# EAGLE schematic Clock_1 (EAGLE 9.6.2)
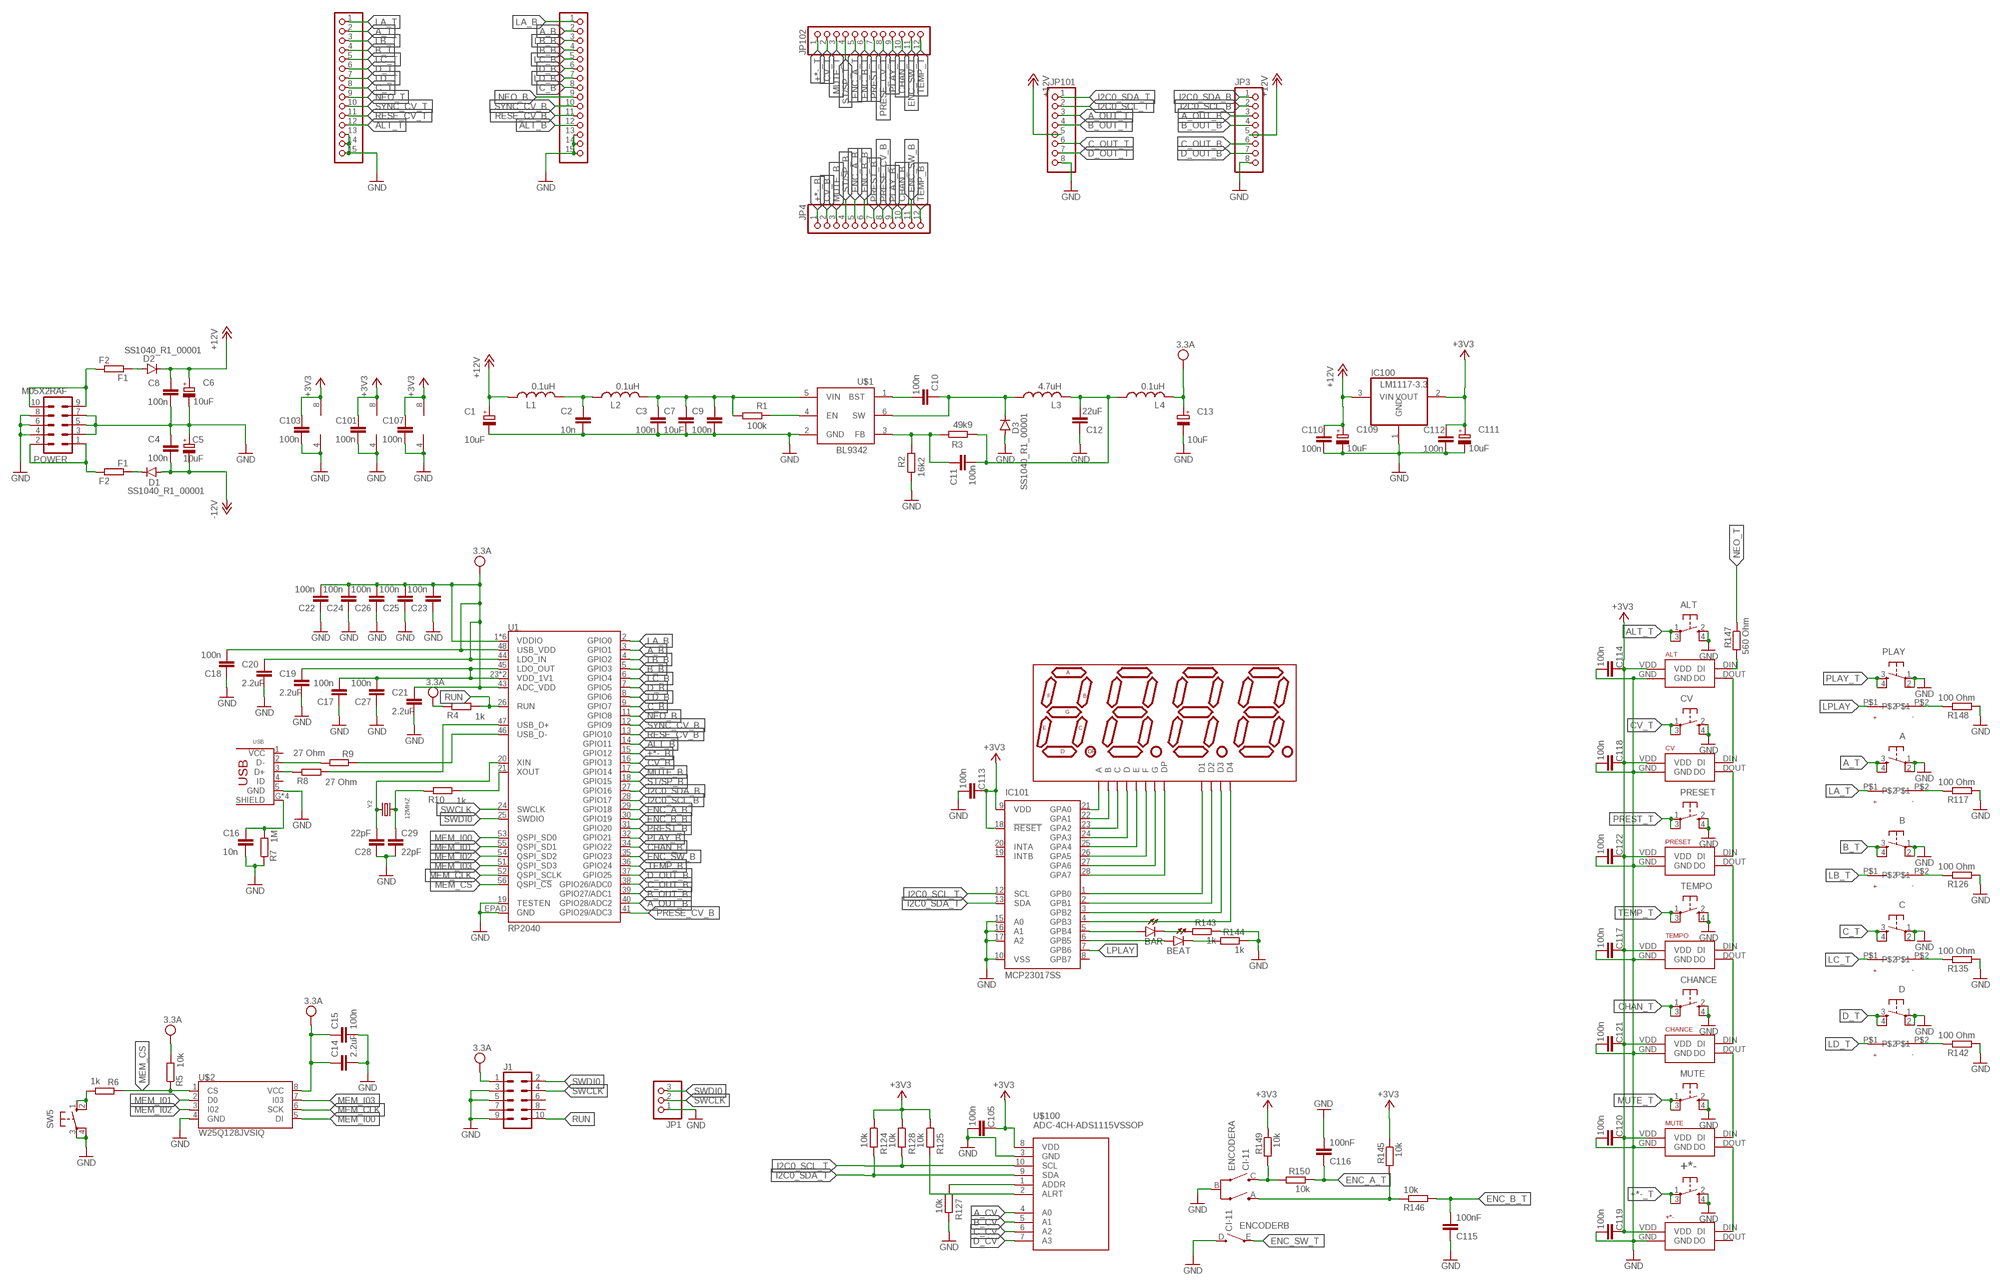
[diagram p0: schematic, sheet 1, part 1 of 2]
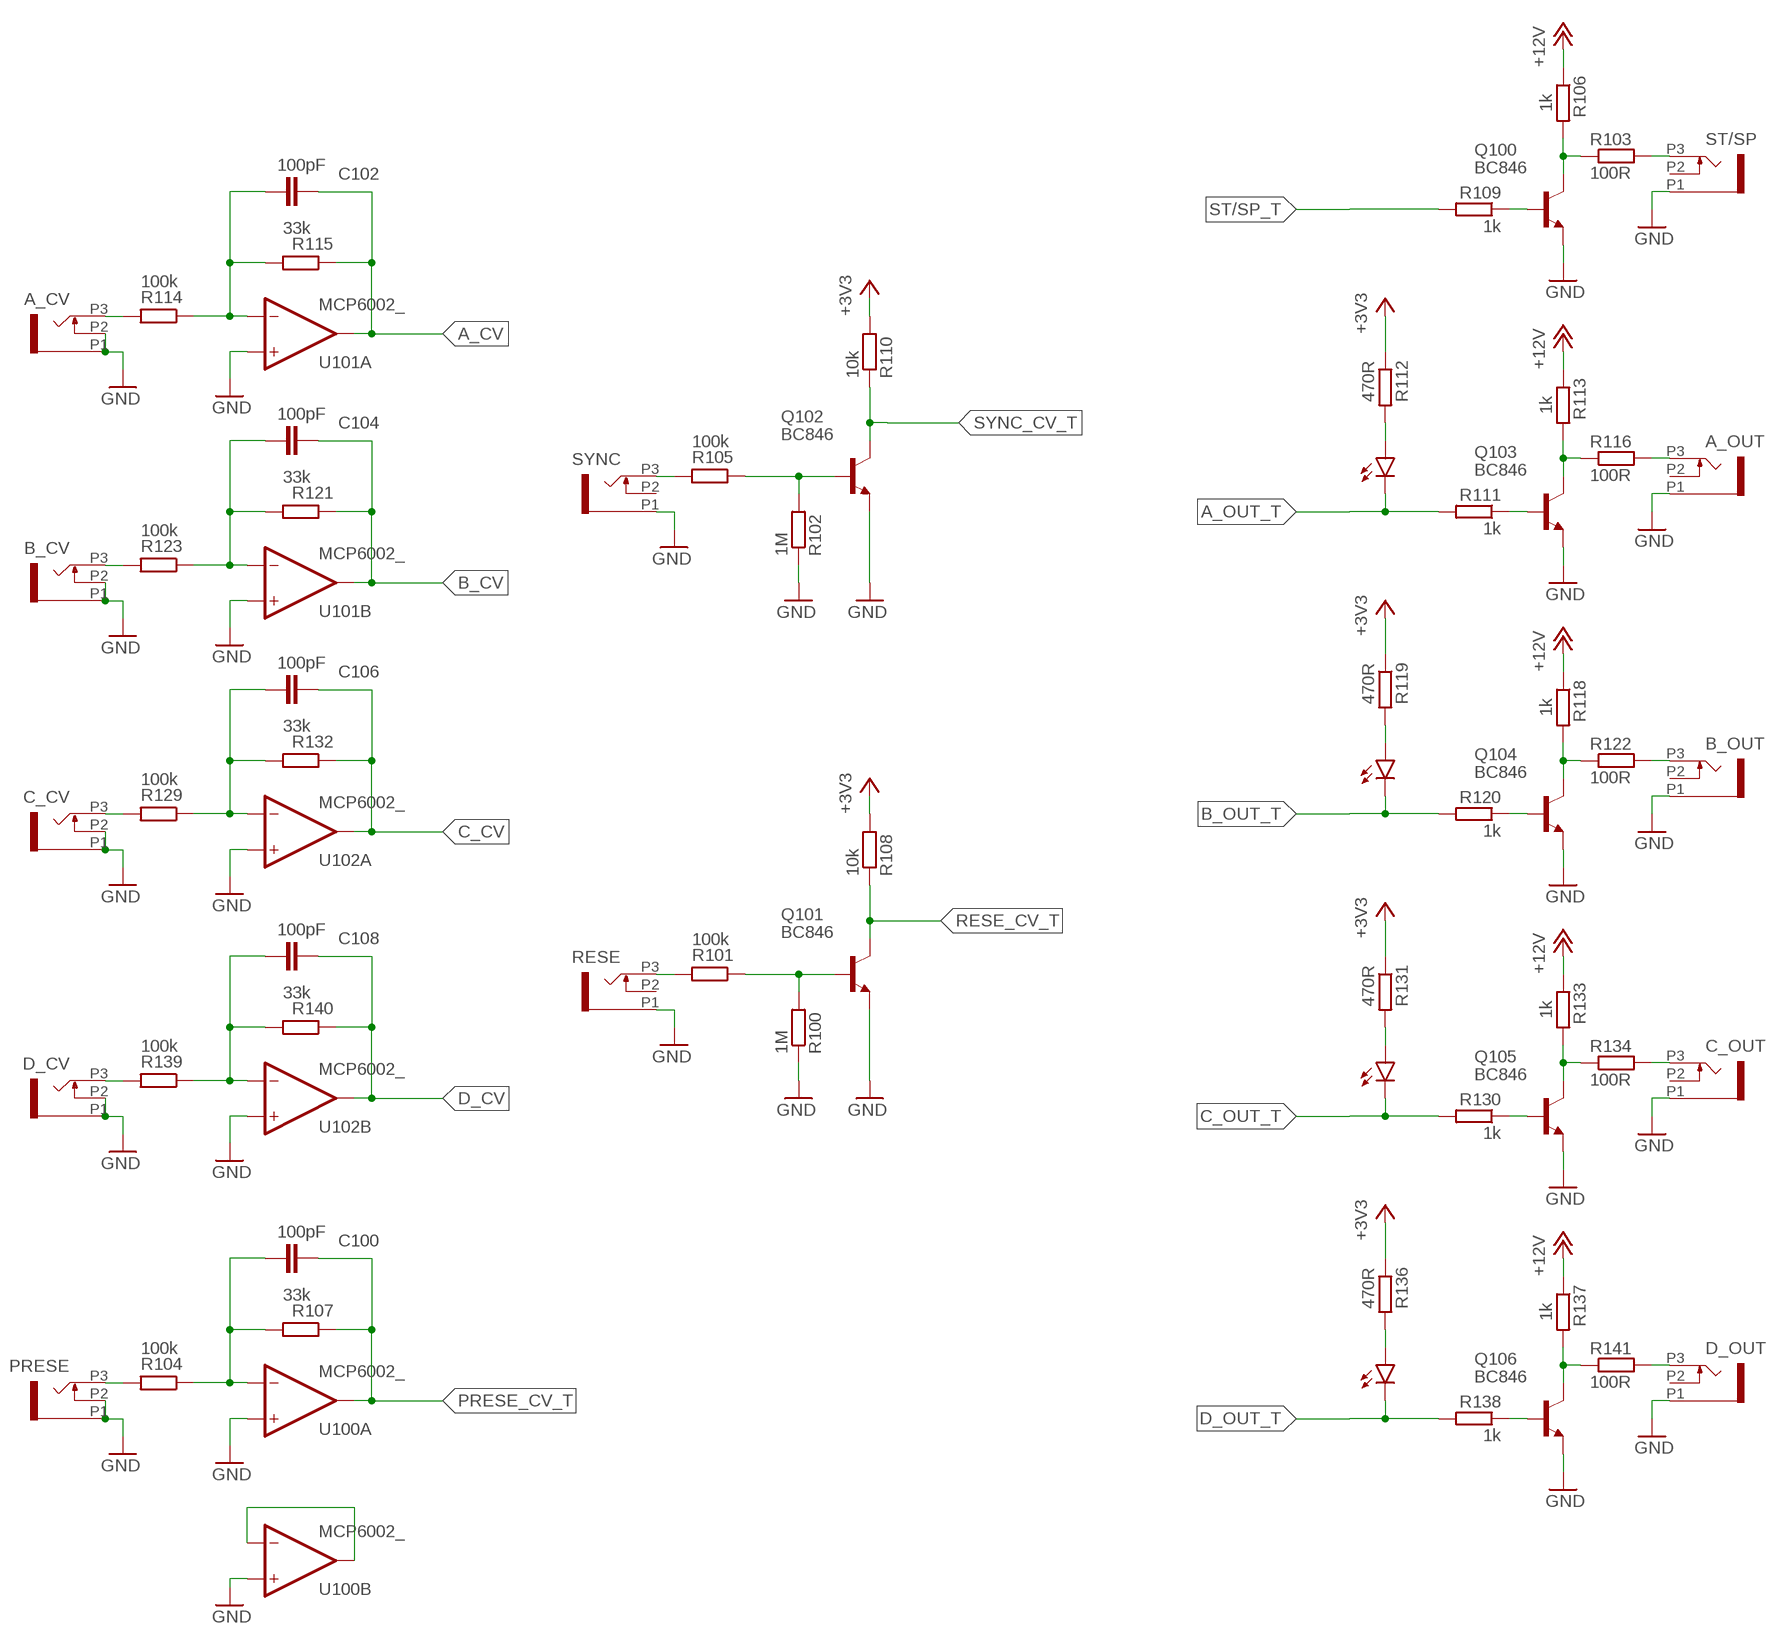
[diagram p1: schematic, sheet 1, part 2 of 2]

## Parts
+*-  BUTTON_NEOPIXELBUTTON_PIXEL_ç  [BUTTON_PIXEL_ç]
A  DTS-6_LEDTME  [TMEBUTTON]
A_CV  OG-PJ301_PJ301_THONKICONNNOHOLER  OG-PJ301_PJ301_THONKICONNNOHOLER_GND_SHORT_PADMINI_GND  [NOHOLER_GND_SHORT_PADMINI_GND]
A_OUT  OG-PJ301_PJ301_THONKICONNNOHOLER  OG-PJ301_PJ301_THONKICONNNOHOLER_GND_SHORT_PADMINI_GND  [NOHOLER_GND_SHORT_PADMINI_GND]
ALT  BUTTON_NEOPIXELBUTTON_PIXEL_ç  [BUTTON_PIXEL_ç]
B  DTS-6_LEDTME  [TMEBUTTON]
B_CV  OG-PJ301_PJ301_THONKICONNNOHOLER  OG-PJ301_PJ301_THONKICONNNOHOLER_GND_SHORT_PADMINI_GND  [NOHOLER_GND_SHORT_PADMINI_GND]
B_OUT  OG-PJ301_PJ301_THONKICONNNOHOLER  OG-PJ301_PJ301_THONKICONNNOHOLER_GND_SHORT_PADMINI_GND  [NOHOLER_GND_SHORT_PADMINI_GND]
BAR  2 MM LED  LED3MM  [LED3MM]
BEAT  2 MM LED  LED3MM  [LED3MM]
C  DTS-6_LEDTME  [TMEBUTTON]
C1  10uF  CPOL-EUB  [PANASONIC_B]
C2  10n  C-EUC0603  [C0603]
C3  100n  C-EUC0603  [C0603]
C4  100n  C-EUC0603  [C0603]
C5  10uF  CPOL-EUB  [PANASONIC_B]
C6  10uF  CPOL-EUB  [PANASONIC_B]
C7  10uF  C-EUC0603  [C0603]
C8  100n  C-EUC0603  [C0603]
C9  100n  C-EUC0603  [C0603]
C10  100n  C-EUC0603  [C0603]
C11  100n  C-EUC0603  [C0603]
C12  22uF  C-EUC0603  [C0603]
C13  10uF  CPOL-EUB  [PANASONIC_B]
C14  2.2uF  C-EUC0603  [C0603]
C15  100n  C-EUC0603  [C0603]
C16  10n  C-EUC0603  [C0603]
C17  100n  C-EUC0603  [C0603]
C18  100n  C-EUC0603  [C0603]
C19  2.2uF  C-EUC0603  [C0603]
C20  2.2uF  C-EUC0603  [C0603]
C21  2.2uF  C-EUC0603  [C0603]
C22  100n  C-EUC0603  [C0603]
C23  100n  C-EUC0603  [C0603]
C24  100n  C-EUC0603  [C0603]
C25  100n  C-EUC0603  [C0603]
C26  100n  C-EUC0603  [C0603]
C27  100n  C-EUC0603  [C0603]
C28  22pF  C-EUC0603  [C0603]
C29  22pF  C-EUC0603  [C0603]
C100  100pF  C-EUC0603  [C0603]
C101  100n  C-EUC0603  [C0603]
C102  100pF  C-EUC0603  [C0603]
C103  100n  C-EUC0603  [C0603]
C104  100pF  C-EUC0603  [C0603]
C105  100n  C-EUC0603  [C0603]
C106  100pF  C-EUC0603  [C0603]
C107  100n  C-EUC0603  [C0603]
C108  100pF  C-EUC0603  [C0603]
C109  10uF  CPOL-EUB  [PANASONIC_B]
C110  100n  C-EUC0603  [C0603]
C111  10uF  CPOL-EUB  [PANASONIC_B]
C112  100n  C-EUC0603  [C0603]
C113  100n  C-EUC0603  [C0603]
C114  100n  C-EUC0603  [C0603]
C115  100nF  C-EUC0603  [C0603]
C116  100nF  C-EUC0603  [C0603]
C117  100n  C-EUC0603  [C0603]
C118  100n  C-EUC0603  [C0603]
C119  100n  C-EUC0603  [C0603]
C120  100n  C-EUC0603  [C0603]
C121  100n  C-EUC0603  [C0603]
C122  100n  C-EUC0603  [C0603]
C_CV  OG-PJ301_PJ301_THONKICONNNOHOLER  OG-PJ301_PJ301_THONKICONNNOHOLER_GND_SHORT_PADMINI_GND  [NOHOLER_GND_SHORT_PADMINI_GND]
C_OUT  OG-PJ301_PJ301_THONKICONNNOHOLER  OG-PJ301_PJ301_THONKICONNNOHOLER_GND_SHORT_PADMINI_GND  [NOHOLER_GND_SHORT_PADMINI_GND]
CHANCE  BUTTON_NEOPIXELBUTTON_PIXEL_ç  [BUTTON_PIXEL_ç]
CV  BUTTON_NEOPIXELBUTTON_PIXEL_ç  [BUTTON_PIXEL_ç]
D  DTS-6_LEDTME  [TMEBUTTON]
D1  SS1040_R1_00001  DIODE-SOD123  [SOD123]
D2  SS1040_R1_00001  DIODE-SOD123  [SOD123]
D3  SS1040_R1_00001  DIODE-SOD123  [SOD123]
D_CV  OG-PJ301_PJ301_THONKICONNNOHOLER  OG-PJ301_PJ301_THONKICONNNOHOLER_GND_SHORT_PADMINI_GND  [NOHOLER_GND_SHORT_PADMINI_GND]
D_OUT  OG-PJ301_PJ301_THONKICONNNOHOLER  OG-PJ301_PJ301_THONKICONNNOHOLER_GND_SHORT_PADMINI_GND  [NOHOLER_GND_SHORT_PADMINI_GND]
ENCODER  CI-11  [CI-11]
F1  F2  R-EU_R0603  [R0603]
F2  F1  R-EU_R0603  [R0603]
IC100  LM1117-3.3  REG1117  [SOT223]
IC101  MCP23017SS  [SSOP28]
J1  CONN_05X2RA  [2X5-RA]
JP1  PINHD-1X31X3*  [1X3*]
JP2  PINHD-1X151X15ç  [1X15ç]
JP3  PINHD-1X81X8ç  [1X8ç]
JP4  PINHD-1X12Ç  [1X12Ç]
JP100  PINHD-1X151X15ç  [1X15ç]
JP101  PINHD-1X81X8ç  [1X8ç]
JP102  PINHD-1X12Ç  [1X12Ç]
L1  0.1uH  L-USL3225P  [L3225P]
L2  0.1uH  L-USL3225P  [L3225P]
L3  4.7uH  L-USL3225P  [L3225P]
L4  0.1uH  L-USL3225P  [L3225P]
LED_A_OUT  2 MM LED  LED3MM  [LED3MM]
LED_B_OUT  2 MM LED  LED3MM  [LED3MM]
LED_C_OUT  2 MM LED  LED3MM  [LED3MM]
LED_D_OUT  2 MM LED  LED3MM  [LED3MM]
LFD36BUE-101B  7-SEGMENT-4DIGIT-20MM  [7-SEGMENT-4DIGIT-30MM]
MUTE  BUTTON_NEOPIXELBUTTON_PIXEL_ç  [BUTTON_PIXEL_ç]
PLAY  DTS-6_LED  [TIMEBUTTON_HOLES_LEDS]
POWER  M05X2RAF  [2X5-POWER_ACODADO]
PRESE  OG-PJ301_PJ301_THONKICONNNOHOLER  OG-PJ301_PJ301_THONKICONNNOHOLER_GND_SHORT_PADMINI_GND  [NOHOLER_GND_SHORT_PADMINI_GND]
PRESET  BUTTON_NEOPIXELBUTTON_PIXEL_ç  [BUTTON_PIXEL_ç]
Q100  BC846  [SOT23]
Q101  BC846  [SOT23]
Q102  BC846  [SOT23]
Q103  BC846  [SOT23]
Q104  BC846  [SOT23]
Q105  BC846  [SOT23]
Q106  BC846  [SOT23]
R1  100k  R-EU_R0603  [R0603]
R2  16k2  R-EU_R0603  [R0603]
R3  49k9  R-EU_R0603  [R0603]
R4  1k  R-EU_R0603  [R0603]
R5  10k  R-EU_R0603  [R0603]
R6  1k  R-EU_R0603  [R0603]
R7  1M  R-EU_R0603  [R0603]
R8  27 Ohm  R-EU_R0603  [R0603]
R9  27 Ohm  R-EU_R0603  [R0603]
R10  1k  R-EU_R0603  [R0603]
R100  1M  R-EU_R0603  [R0603]
R101  100k  R-EU_R0603  [R0603]
R102  1M  R-EU_R0603  [R0603]
R103  100R  R-EU_R0603  [R0603]
R104  100k  R-EU_R0603  [R0603]
R105  100k  R-EU_R0603  [R0603]
R106  1k  R-EU_R0603  [R0603]
R107  33k  R-EU_R0603  [R0603]
R108  10k  R-EU_R0603  [R0603]
R109  1k  R-EU_R0603  [R0603]
R110  10k  R-EU_R0603  [R0603]
R111  1k  R-EU_R0603  [R0603]
R112  470R  R-EU_R0603  [R0603]
R113  1k  R-EU_R0603  [R0603]
R114  100k  R-EU_R0603  [R0603]
R115  33k  R-EU_R0603  [R0603]
R116  100R  R-EU_R0603  [R0603]
R117  100 Ohm  R-EU_R0603  [R0603]
R118  1k  R-EU_R0603  [R0603]
R119  470R  R-EU_R0603  [R0603]
R120  1k  R-EU_R0603  [R0603]
R121  33k  R-EU_R0603  [R0603]
R122  100R  R-EU_R0603  [R0603]
R123  100k  R-EU_R0603  [R0603]
R124  10k  R-EU_R0603  [R0603]
R125  10k  R-EU_R0603  [R0603]
R126  100 Ohm  R-EU_R0603  [R0603]
R127  10k  R-EU_R0603  [R0603]
R128  10k  R-EU_R0603  [R0603]
R129  100k  R-EU_R0603  [R0603]
R130  1k  R-EU_R0603  [R0603]
R131  470R  R-EU_R0603  [R0603]
R132  33k  R-EU_R0603  [R0603]
R133  1k  R-EU_R0603  [R0603]
R134  100R  R-EU_R0603  [R0603]
R135  100 Ohm  R-EU_R0603  [R0603]
R136  470R  R-EU_R0603  [R0603]
R137  1k  R-EU_R0603  [R0603]
R138  1k  R-EU_R0603  [R0603]
R139  100k  R-EU_R0603  [R0603]
R140  33k  R-EU_R0603  [R0603]
R141  100R  R-EU_R0603  [R0603]
R142  100 Ohm  R-EU_R0603  [R0603]
R143  1k  R-EU_R0603  [R0603]
R144  1k  R-EU_R0603  [R0603]
R145  10k  R-EU_R0603  [R0603]
R146  10k  R-EU_R0603  [R0603]
R147  560 Ohm  R-EU_R0603  [R0603]
R148  100 Ohm  R-EU_R0603  [R0603]
R149  10k  R-EU_R0603  [R0603]
R150  10k  R-EU_R0603  [R0603]
RESE  OG-PJ301_PJ301_THONKICONNNOHOLER  OG-PJ301_PJ301_THONKICONNNOHOLER_GND_SHORT_PADMINI_GND  [NOHOLER_GND_SHORT_PADMINI_GND]
ST/SP  OG-PJ301_PJ301_THONKICONNNOHOLER  OG-PJ301_PJ301_THONKICONNNOHOLER_GND_SHORT_PADMINI_GND  [NOHOLER_GND_SHORT_PADMINI_GND]
SW5  10-XX  [B3F-10XX]
SYNC  OG-PJ301_PJ301_THONKICONNNOHOLER  OG-PJ301_PJ301_THONKICONNNOHOLER_GND_SHORT_PADMINI_GND  [NOHOLER_GND_SHORT_PADMINI_GND]
TEMPO  BUTTON_NEOPIXELBUTTON_PIXEL_ç  [BUTTON_PIXEL_ç]
U1  RP2040  [QFN-56]
U100  MCP6002_  [SO08]
U101  MCP6002_  [SO08]
U102  MCP6002_  [SO08]
U$1  BL9342  [SOT23-6]
U$2  W25Q128JVSIQ  [SOIC-8]
U$100  ADC-4CH-ADS1115VSSOP  [ADC-4CH-ADS1115-VSSOP]
USB  USB_HRS_ZX62-B-5PA(11)MICRO.B  [HRS_ZX62RD-AB-5P8]
Y2  12MHZ  CRYSTAL2.5X2.0  [CRYSTAL_2.5X2]

## Nets
+3V3: +*-.VDD ALT.VDD C101.1 C103.1 C105.1 C107.1 C111.+ C112.1 C113.1 C114.1 C117.1 C118.1 C119.1 C120.1 C121.1 C122.1 CHANCE.VDD CV.VDD IC100.2(VOUT) IC101.9(VDD) IC101.18(!RESET) MUTE.VDD PRESET.VDD R108.2 R110.2 R112.1 R119.1 R124.1 R125.1 R128.1 R131.1 R136.1 R145.1 R149.1 TEMPO.VDD U100.8(P:V+) U101.8(P:V+) U102.8(P:V+) U$100.8(VDD)
+12V: C1.+ C6.+ C8.1 C109.+ C110.1 D2.C IC100.3(VIN) JP3.5 JP101.5 L1.1 R106.1 R113.1 R118.1 R133.1 R137.1
+*-_B: JP4.1 U1.15(GPIO12)
+*-_T: +*-.1 +*-.3 JP102.1
-12V: C4.2 C5.- D1.A
A_B: JP2.2 U1.3(GPIO1)
A_CV: C102.2 R115.1 U101.1(A:OUT) U$100.4(A0)
A_OUT_B: JP3.3 U1.40(GPIO28/ADC2)
A_OUT_T: JP101.3 LED_A_OUT.K(C) R111.2
A_T: A.3 A.4 JP100.2
ALT_B: JP2.12 U1.14(GPIO11)
ALT_T: ALT.1 ALT.3 JP100.12
B_B: JP2.4 U1.5(GPIO3)
B_CV: C104.2 R121.1 U101.7(B:OUT) U$100.5(A1)
B_OUT_B: JP3.4 U1.39(GPIO27/ADC1)
B_OUT_T: JP101.4 LED_B_OUT.K(C) R120.2
B_T: B.3 B.4 JP100.4
C_B: JP2.8 U1.9(GPIO7)
C_CV: C106.2 R132.1 U102.1(A:OUT) U$100.6(A2)
C_OUT_B: JP3.6 U1.38(GPIO26/ADC0)
C_OUT_T: JP101.6 LED_C_OUT.K(C) R130.2
C_T: C.3 C.4 JP100.8
CHAN_B: JP4.10 U1.34(GPIO22)
CHAN_T: CHANCE.1 CHANCE.3 JP102.10
CV_B: JP4.2 U1.16(GPIO13)
CV_T: CV.1 CV.3 JP102.2
D_B: JP2.6 U1.7(GPIO5)
D_CV: C108.2 R140.1 U102.7(B:OUT) U$100.7(A3)
D_OUT_B: JP3.7 U1.37(GPIO25)
D_OUT_T: JP101.7 LED_D_OUT.K(C) R138.2
D_T: D.3 D.4 JP100.6
ENC_A_B: JP4.5 U1.29(GPIO18)
ENC_A_T: C116.1 JP102.5 R150.1
ENC_B_B: JP4.6 U1.30(GPIO19)
ENC_B_T: C115.2 JP102.6 R146.2
ENC_SW_B: JP4.11 U1.35(GPIO23)
ENC_SW_T: ENCODER.E(B:E) JP102.11
GND: +*-.2 +*-.4 +*-.GND A.1 A.2 A_CV.P1 A_CV.P2 A_OUT.P1 ALT.2 ALT.4 ALT.GND B.1 B.2 B_CV.P1 B_CV.P2 B_OUT.P1 C1.- C2.2 C3.2 C4.1 C5.+ C6.- C7.2 C8.2 C9.2 C12.1 C13.- C14.2 C15.2 C16.2 C17.1 C18.1 C19.2 C20.2 C21.2 C22.1 C23.1 C24.1 C25.1 C26.1 C27.1 C28.1 C29.2 C101.2 C103.2 C105.2 C107.2 C109.- C110.2 C111.- C112.2 C113.2 C114.2 C115.1 C116.2 C117.2 C118.2 C119.2 C120.2 C121.2 C122.2 C.1 C.2 C_CV.P1 C_CV.P2 C_OUT.P1 CHANCE.2 CHANCE.4 CHANCE.GND CV.2 CV.4 CV.GND D3.A D.1 D.2 D_CV.P1 D_CV.P2 D_OUT.P1 ENCODER.B(A:C) ENCODER.D(B:D) IC100.1(GND) IC101.10(VSS) IC101.15(A0) IC101.16(A1) IC101.17(A2) J1.3 J1.5 J1.9 JP1.1 JP2.13 JP2.14 JP2.15 JP3.8 JP100.13 JP100.14 JP100.15 JP101.8 MUTE.2 MUTE.4 MUTE.GND PLAY.1 PLAY.2 POWER.3 POWER.4 POWER.5 POWER.6 POWER.7 POWER.8 PRESE.P1 PRESE.P2 PRESET.2 PRESET.4 PRESET.GND Q100.2(E) Q101.2(E) Q102.2(E) Q103.2(E) Q104.2(E) Q105.2(E) Q106.2(E) R2.1 R7.1 R100.1 R102.1 R117.2 R126.2 R127.2 R135.2 R142.2 R143.1 R144.1 R148.2 RESE.P1 ST/SP.P1 SW5.3(P) SW5.4(P1) SYNC.P1 TEMPO.2 TEMPO.4 TEMPO.GND U1.19(TESTEN) U1.EPAD(GND) U100.3(A:+IN) U100.4(P:V-) U100.5(B:+IN) U101.3(A:+IN) U101.4(P:V-) U101.5(B:+IN) U102.3(A:+IN) U102.4(P:V-) U102.5(B:+IN) U$1.2(GND) U$2.4(GND) U$100.3(GND) USB.5(GND)
I2C0_SCL_B: JP3.2 U1.28(GPIO17)
I2C0_SCL_T: IC101.12(SCL) JP101.2 R128.2 U$100.10(SCL)
I2C0_SDA_B: JP3.1 U1.27(GPIO16)
I2C0_SDA_T: IC101.13(SDA) JP101.1 R124.2 U$100.9(SDA)
LA_B: JP2.1 U1.2(GPIO0)
LA_T: A.P$1 JP100.1
LB_B: JP2.3 U1.4(GPIO2)
LB_T: B.P$1 JP100.3
LC_B: JP2.5 U1.6(GPIO4)
LC_T: C.P$1 JP100.5
LD_B: JP2.7 U1.8(GPIO6)
LD_T: D.P$1 JP100.7
LPLAY: IC101.7(GPB6) PLAY.P$1
MEM_CLK: U1.52(QSPI_SCLK) U$2.6(SCK)
MEM_CS: R5.1 R6.1 U1.56(QSPI_!CS!) U$2.1(CS)
MEM_I00: U1.53(QSPI_SD0) U$2.5(DI)
MEM_I01: U1.55(QSPI_SD1) U$2.2(D0)
MEM_I02: U1.54(QSPI_SD2) U$2.3(I02)
MEM_I03: U1.51(QSPI_SD3) U$2.7(I03)
MUTE_B: JP4.3 U1.17(GPIO14)
MUTE_T: JP102.3 MUTE.1 MUTE.3
N$1: R10.2 U1.21(XOUT)
N$2: C28.2 U1.20(XIN) Y2.3
N$3: C29.1 R10.1 Y2.1
N$4: R1.2 U$1.4(EN)
N$5: C3.1 C7.1 C9.1 L2.2 R1.1 U$1.5(VIN)
N$6: C2.1 L1.2 L2.1
N$7: C10.2 U$1.1(BST)
N$8: C10.1 D3.C L3.1 U$1.6(SW)
N$9: C11.1 R2.2 R3.2 U$1.3(FB)
N$10: C11.2 C12.2 L3.2 L4.1 R3.1
N$11: IC101.21(GPA0) LFD36BUE-101B.11(A)
N$12: R8.2 U1.47(USB_D+)
N$13: BAR.A IC101.5(GPB4)
N$14: R9.1 U1.46(USB_D-)
N$15: C16.1 R7.2 USB.G2(SHIELD) USB.G3(SHIELD) USB.G4(SHIELD) USB.G(SHIELD)
N$16: IC101.22(GPA1) LFD36BUE-101B.7(B)
N$17: R6.2 SW5.1(S) SW5.2(S1)
N$18: IC101.23(GPA2) LFD36BUE-101B.4(C)
N$19: IC101.24(GPA3) LFD36BUE-101B.2(D)
N$20: IC101.25(GPA4) LFD36BUE-101B.1(E)
N$21: IC101.26(GPA5) LFD36BUE-101B.10(F)
N$22: IC101.27(GPA6) LFD36BUE-101B.5(G)
N$23: IC101.28(GPA7) LFD36BUE-101B.3(DP)
N$24: IC101.1(GPB0) LFD36BUE-101B.12(D1)
N$25: IC101.2(GPB1) LFD36BUE-101B.9(D2)
N$26: IC101.3(GPB2) LFD36BUE-101B.8(D3)
N$27: IC101.4(GPB3) LFD36BUE-101B.6(D4)
N$28: C102.1 R114.1 R115.2 U101.2(A:-IN)
N$29: ALT.DIN(DI) R147.2
N$30: ALT.DOUT(DO) CV.DIN(DI)
N$31: CV.DOUT(DO) PRESET.DIN(DI)
N$32: PRESET.DOUT(DO) TEMPO.DIN(DI)
N$33: CHANCE.DIN(DI) TEMPO.DOUT(DO)
N$34: CHANCE.DOUT(DO) MUTE.DIN(DI)
N$35: +*-.DIN(DI) MUTE.DOUT(DO)
N$36: U100.6(B:-IN) U100.7(B:OUT)
N$37: C104.1 R121.2 R123.1 U101.6(B:-IN)
N$38: C106.1 R129.1 R132.2 U102.2(A:-IN)
N$39: C108.1 R139.1 R140.2 U102.6(B:-IN)
N$40: PLAY.P$2 R148.1
N$41: A.P$2 R117.1
N$42: B.P$2 R126.1
N$43: F2.2 POWER.9 POWER.10
N$44: D2.A F2.1
N$45: F1.2 POWER.1 POWER.2
N$46: D1.C F1.1
N$47: C.P$2 R135.1
N$48: D.P$2 R142.1
N$49: A_OUT.P3 R116.2
N$50: B_OUT.P3 R122.2
N$51: Q102.1(B) R102.2 R105.1
N$52: C_OUT.P3 R134.2
N$53: Q101.1(B) R100.2 R101.1
N$54: D_OUT.P3 R141.2
N$55: Q100.1(B) R109.1
N$56: A_CV.P3 R114.2
N$57: B_CV.P3 R123.2
N$58: C_CV.P3 R129.2
N$59: D_CV.P3 R139.2
N$60: R103.2 ST/SP.P3
N$61: Q100.3(C) R103.1 R106.2
N$62: R105.2 SYNC.P3
N$63: PRESE.P3 R104.2
N$64: R101.2 RESE.P3
N$65: ENCODER.A(A:A) R145.2 R146.1
N$66: ENCODER.C(A:B) R149.2 R150.2
N$67: BAR.K(C) R143.2
N$68: BEAT.A IC101.6(GPB5)
N$69: BEAT.K(C) R144.2
N$71: R8.1 USB.3(D+)
N$72: C100.1 R104.1 R107.2 U100.2(A:-IN)
N$73: R127.1 U$100.1(ADDR)
N$74: R125.2 U$100.2(ALRT)
N$75: Q103.1(B) R111.1
N$76: Q103.3(C) R113.2 R116.1
N$77: LED_A_OUT.A R112.2
N$78: R9.2 USB.2(D-)
N$79: Q104.1(B) R120.1
N$80: Q104.3(C) R118.2 R122.1
N$81: LED_B_OUT.A R119.2
N$83: Q105.1(B) R130.1
N$84: Q105.3(C) R133.2 R134.1
N$85: LED_C_OUT.A R131.2
N$86: C17.2 C19.1 C27.2 U1.23(VDD_1V1) U1.45(LDO_OUT) U1.50(VDD_1V1)
N$87: Q106.1(B) R138.1
N$88: Q106.3(C) R137.2 R141.1
N$89: LED_D_OUT.A R136.2
NEO_B: JP2.9 U1.11(GPIO8)
NEO_T: JP100.9 R147.1
PLAY_B: JP4.9 U1.32(GPIO21)
PLAY_T: JP102.9 PLAY.3 PLAY.4
PRESE_CV_B: JP4.8 U1.41(GPIO29/ADC3)
PRESE_CV_T: C100.2 JP102.8 R107.1 U100.1(A:OUT)
PREST_B: JP4.7 U1.31(GPIO20)
PREST_T: JP102.7 PRESET.1 PRESET.3
RESE_CV_B: JP2.11 U1.13(GPIO10)
RESE_CV_T: JP100.11 Q101.3(C) R108.1
RUN: J1.10 R4.2 U1.26(RUN)
ST/SP_B: JP4.4 U1.18(GPIO15)
ST/SP_T: JP102.4 R109.2
SWCLK: J1.4 JP1.2 U1.24(SWCLK)
SWDI0: J1.2 JP1.3 U1.25(SWDIO)
SYNC_CV_B: JP2.10 U1.12(GPIO9)
SYNC_CV_T: JP100.10 Q102.3(C) R110.1
TEMP_B: JP4.12 U1.36(GPIO24)
TEMP_T: JP102.12 TEMPO.1 TEMPO.3
VCC: C13.+ C14.1 C15.1 C18.2 C20.1 C21.1 C22.2 C23.2 C24.2 C25.2 C26.2 J1.1 L4.2 R4.1 R5.2 U1.1(VDDIO) U1.10(VDDIO) U1.22(VDDIO) U1.33(VDDIO) U1.42(VDDIO) U1.43(ADC_VDD) U1.44(LDO_IN) U1.48(USB_VDD) U1.49(VDDIO) U$2.8(VCC) ; supply symbol labelled 3.3A
Unconnected: +*-.DOUT(DO) A_OUT.P2 B_OUT.P2 C_OUT.P2 D_OUT.P2 IC101.8(GPB7) IC101.19(INTB) IC101.20(INTA) J1.6 J1.7 J1.8 RESE.P2 ST/SP.P2 SYNC.P2 USB.1(VCC) USB.4(ID)

## Library data of the parts
+*- ALT CHANCE CV MUTE PRESET TEMPO = switch-tact:BUTTON_NEOPIXEL
A B C D PLAY = switch-tact:DTS-6_LED
A_CV A_OUT B_CV B_OUT C_CV C_OUT D_CV D_OUT PRESE RESE ST/SP SYNC = Thonkikonn:OG-PJ301_PJ301_THONKICONN
BAR BEAT LED_A_OUT LED_B_OUT LED_C_OUT LED_D_OUT = led:LED: LED OSRAM: - CHIPLED LG R971, LG N971, LY N971, LG Q971, LY Q971, LO R971, LY R971 LH N974, LH R974 LS Q976, LO Q976, LY Q976 LO Q996 - Hyper CHIPLED LW Q18S LB Q993, LB Q99A, LB R99A - SideLED LS A670, LO A670, LY A670, LG A670, LP A670 LB A673, LV A673, LT A673, LW A673 LH A674 LY A675 LS A676, LA A676, LO A676, LY A676, LW A676 LS A679, LY A679, LG A679 - Hyper Micro SIDELED® LS Y876, LA Y876, LO Y876, LY Y876 LT Y87S - SmartLED LW L88C, LW L88S LB L89C, LB L89S, LG L890 LS L89K, LO L89K, LY L89K LS L896, LA L896, LO L896, LY L896 - TOPLED LS T670, LO T670, LY T670, LG T670, LP T670 LSG T670, LSP T670, LSY T670, LOP T670, LYG T670 LG T671, LOG T671, LSG T671 LB T673, LV T673, LT T673, LW T673 LH T674 LS T676, LA T676, LO T676, LY T676, LB T676, LH T676, LSB T676, LW T676 LB T67C, LV T67C, LT T67C, LS T67K, LO T67K, LY T67K, LW E67C LS E67B, LA E67B, LO E67B, LY E67B, LB E67C, LV E67C, LT E67C LW T67C LS T679, LY T679, LG T679 LS T770, LO T770, LY T770, LG T770, LP T770 LB T773, LV T773, LT T773, LW T773 LH T774 LS E675, LA E675, LY E675, LS T675 LS T776, LA T776, LO T776, LY T776, LB T776 LHGB T686 LT T68C, LB T68C - Hyper Mini TOPLED® LB M676 - Mini TOPLED Santana® LG M470 LS M47K, LO M47K, LY M47K Source: http://www.osram.convergy.de LUXEON: - LUMILED® LXK2-PW12-R00, LXK2-PW12-S00, LXK2-PW14-U00, LXK2-PW14-V00 LXK2-PM12-R00, LXK2-PM12-S00, LXK2-PM14-U00 LXK2-PE12-Q00, LXK2-PE12-R00, LXK2-PE12-S00, LXK2-PE14-T00, LXK2-PE14-U00 LXK2-PB12-K00, LXK2-PB12-L00, LXK2-PB12-M00, LXK2-PB14-N00, LXK2-PB14-P00, LXK2-PB14-Q00 LXK2-PR12-L00, LXK2-PR12-M00, LXK2-PR14-Q00, LXK2-PR14-R00 LXK2-PD12-Q00, LXK2-PD12-R00, LXK2-PD12-S00 LXK2-PH12-R00, LXK2-PH12-S00 LXK2-PL12-P00, LXK2-PL12-Q00, LXK2-PL12-R00 Source: www.luxeon.com KINGBRIGHT: KA-3528ASYC Source: www.kingbright.com
C1 C5 C6 C13 C109 C111 = rcl:CPOL-EU: POLARIZED CAPACITOR, European symbol
C2-C4 C7-C12 C14-C29 C101 C103 C105 C107 C110 C112-C114 C117-C122 = rcl:C-EU: CAPACITOR, European symbol
C100 C102 C104 C106 C108 C115 C116 = rcl:C-EU: CAPACITOR, European symbol; SPICEPREFIX: C
D1-D3 = diode:DIODE-: DIODE
ENCODER = piher:CI-11: 11mm Incemental Encoder Source: www.piher.net .. 04-CI-11v04.pdf
F1 F2 R1-R10 R100-R144 R147 R148 = rcl:R-EU_: RESISTOR, European symbol
IC100 = og-vreg:REG1117: 800mA and 1A Low Dropout (LDO) Positive Regulator 1.8V, 2.5V, 2.85V, 3.3V, 5V, and Adj
IC101 = adafruit:MCP23017: http://ww1.microchip.com/downloads/en/DeviceDoc/21952a.pdf Source: http://ww1.microchip.com/downloads/en/DeviceDoc/21952a.pdf
J1 = SparkFun-Connectors:CONN_05X2: Multi connection point. Often used as Generic Header-pin footprint for 0.1 inch spaced/style header connections For AVR SPI programming port, see special device with nice symbol: "AVR_SPI_PROG_5x2.dev" You can populate with any combo of single row headers, but if you'd like an exact match, check these: 2x5 AVR ICSP Male Header <https://www.sparkfun.com/products/778> (PRT-00778) 2x5 Pin Shrouded Header <https://www.sparkfun.com/products/8506> (PRT-08506) On any of the 0.1 inch spaced packages, you can populate with these: Break Away Headers - Straight <https://www.sparkfun.com/products/116> (PRT-00116) Break Away Male Headers - Right Angle <https://www.sparkfun.com/products/553> (PRT-00553) Female Headers <https://www.sparkfun.com/products/115> (PRT-00115) Break Away Headers - Machine Pin <https://www.sparkfun.com/products/117> (PRT-00117) Break Away Female Headers - Swiss Machine Pin <https://www.sparkfun.com/products/743> (PRT-00743) Special note: the shrouded connector mates well with our 5x2 ribbon cables: 2x5 Pin IDC Ribbon Cable <https://www.sparkfun.com/products/8535> (PRT-08535)
JP1 = pinhead:PINHD-1X3: PIN HEADER
JP2 JP100 = pinhead:PINHD-1X15: PIN HEADER
JP3 JP101 = pinhead:PINHD-1X8: PIN HEADER
JP4 JP102 = pinhead:PINHD-1X12: PIN HEADER
L1-L4 = rcl:L-US: INDUCTOR, American symbol
LFD36BUE-101B = SparkFun-LED:7-SEGMENT-4DIGIT-20MM: 4 Digit 7 Segment Display This is a part for the 4-Digit 7-segment LEDs from Young Sun. Different from the Digikey LEDs, all 16 pins are used. The LONGPADS Variant is used for a test jig, but you may like it because there is more pad to solder to. If you are concerned about routing space, the standard works just fine though. Datasheets: Red <http://cdn.sparkfun.com/datasheets/Components/LED/1LEDREDCC.pdf> Yellow <http://cdn.sparkfun.com/datasheets/Components/LED/1LEDYELCC.pdf> Green <http://cdn.sparkfun.com/datasheets/Components/LED/1LEDGRNCC.pdf> Blue <http://cdn.sparkfun.com/datasheets/Components/LED/1LEDBLUCC.pdf> White <http://cdn.sparkfun.com/datasheets/Components/LED/1LEDWHTCC.pdf> SparkFun Products Raw Components 7-Segment Display - 20mm (Red) <https://www.sparkfun.com/products/11405> (COM-11405) 7-Segment Display - 20mm (Yellow) <https://www.sparkfun.com/products/11406> (COM-11406) 7-Segment Display - 20mm (Green) <https://www.sparkfun.com/products/11407> (COM-11407) 7-Segment Display - 20mm (Blue) <https://www.sparkfun.com/products/11408> (COM-11408) 7-Segment Display - 20mm (White) <https://www.sparkfun.com/products/11409> (COM-11409) Serial Controlled SparkFun OpenSegment Serial Display - 20mm (Red) <https://www.sparkfun.com/products/11644> (COM-11644) SparkFun OpenSegment Serial Display - 20mm (Yellow) <https://www.sparkfun.com/products/11645> (COM-11645) SparkFun OpenSegment Serial Display - 20mm (Green) <https://www.sparkfun.com/products/11646> (COM-11646) SparkFun OpenSegment Serial Display - 20mm (Blue) <https://www.sparkfun.com/products/11647> (COM-11647) SparkFun OpenSegment Serial Display - 20mm (White) <https://www.sparkfun.com/products/11648> (COM-11648) Other SparkFun OpenSegment Shield <https://www.sparkfun.com/products/13190> (DEV-13190)
POWER = SparkFun:M05X2: Header 5x2 Standard 10-pin dual row 0.1" header. Commonly used with AVR-ISP. Use with Spark Fun Electronics SKU: PRT-00778
Q100-Q106 = transistor:BC846: NPN TRANSISTOR
R145 R146 R149 R150 = rcl:R-EU_: RESISTOR, European symbol; SPICEPREFIX: R
SW5 = switch-omron:10-XX: OMRON SWITCH; MPN: B3F-1000; OC_FARNELL: 176432; OC_NEWARK: 36M3542
U1 = SparkFun-IC-Microcontroller:RP2040: Raspberry Pi RP2040 MCU 56-pin 32-bit Microcontroller with 264kB of SRAM and external flash support up to 16MB Getting Started with the RP2040 <https://pico.raspberrypi.org/getting-started/> Dual-core ARM Cortex M0+ processor, flexible clock running up to 133 MHz 264kB of SRAM, and QSPI control of common flash memory USB 1.1 Host and Device support Low-power sleep and dormant modes Drag & drop programming using mass storage over USB 26 multi-function GPIO pins 2×SPI, 2×I2C, 2×UART, 3×12-bit ADC, 16×controllable PWM channels Accurate clock and timer on-chip Temperature sensor Accelerated floating point libraries on-chip 8×Programmable IO (PIO) state machines for custom peripheral support; PROD_ID: IC-15502
U100-U102 = MTM:MCP6002: Generic Dual Op Amp
U$1 = adafruit:BL9342
U$2 = SparkFun-IC-Memory:W25Q128JVSIQ
U$100 = diy-modules:ADC-4CH-ADS1115: 4 Channel 16-Bit Analog-to-Digital Converter based on ADS1115 chip Arduino ADS1115 Getting Started Tutorial is available here: http://henrysbench.capnfatz.com/henrys-bench/arduino-voltage-measurements/arduino-ads1115-module-getting-started-tutorial/ ADS1115 datasheet is available here: http://www.ti.com/lit/ds/symlink/ads1115.pdf Click here to find device on ebay.com <http://www.ebay.com/sch/ads1115+module>
USB = Rebel:USB_HRS_ZX62-B-5PA(11)MICRO.B
Y2 = microbuilder:CRYSTAL: Crystals HC49UP - Surface Mount Crystal 4.0MHz 18pF +/-30ppm Surface Mount Crystal [Digikey: 535-9857-1-ND] 12.0 MHz Surface Mount Crystal [Digikey: 535-9869-6-ND] 25.0 MHz Surface Mount Crystal [Digikey: 535-9078-1-ND] 2.5 x 2.0mm - MEMs SMT Crystal 16.0 MHz 10pF 20ppm 2.5 x 2.0mm Crystal [Digikey -40-85°C: 535-10923-1-ND] 3.2 x 2.5mm - MEMs SMT Crystal 12.0 MHz 8pF 15ppm 3.2 x 2.5mm Crystal [Digikey: -10-70°C: 644-1047-1-ND -40-125°C: 644-1128-1-ND] 40~85°C cheaper: 644-1173-6-ND 16.0 MHz 8pF 15ppm 3.2 x 2.5mm Crystal [Digikey: -10-70°C: 644-1049-1-ND -40-125°C: 644-1129-2-ND]-40~85°C cheaper: 644-1175-6-ND 16.0 MHz 10pF 10ppm 3.2 x 2.5mm Crystal [Digikey: 644-1100-1-ND] 27.12 MHz 18pF 30ppm 3.2 x 2.5mm Crystal [Digikey: 887-1424-1-ND] 27.12MHz 10pF 10ppm 3.2 x 2.5mm Crystal [Digikey: 887-1329-1-ND] 4.9 x 1.8mm - MEMs SMT Crystal 32.768 KHz 12.5pF 20ppm 4.9 x 1.8mm Crystal [Digikey: SE2415CT-ND] 8.0 x 3.8mm - Surface Mount Crystal 32.768kHz 12.5pF 20ppm -40°C-85°C [Digikey: 535-9166-2-ND] Cylinder 32.768KHz Cylinder Crystal (2x6mm body) [Ex. Digikey: 300-8341-2-ND]